# Altium schematic sheet Quadruped.SchDoc
size A; SheetNumber: 1; SheetTotal: 1
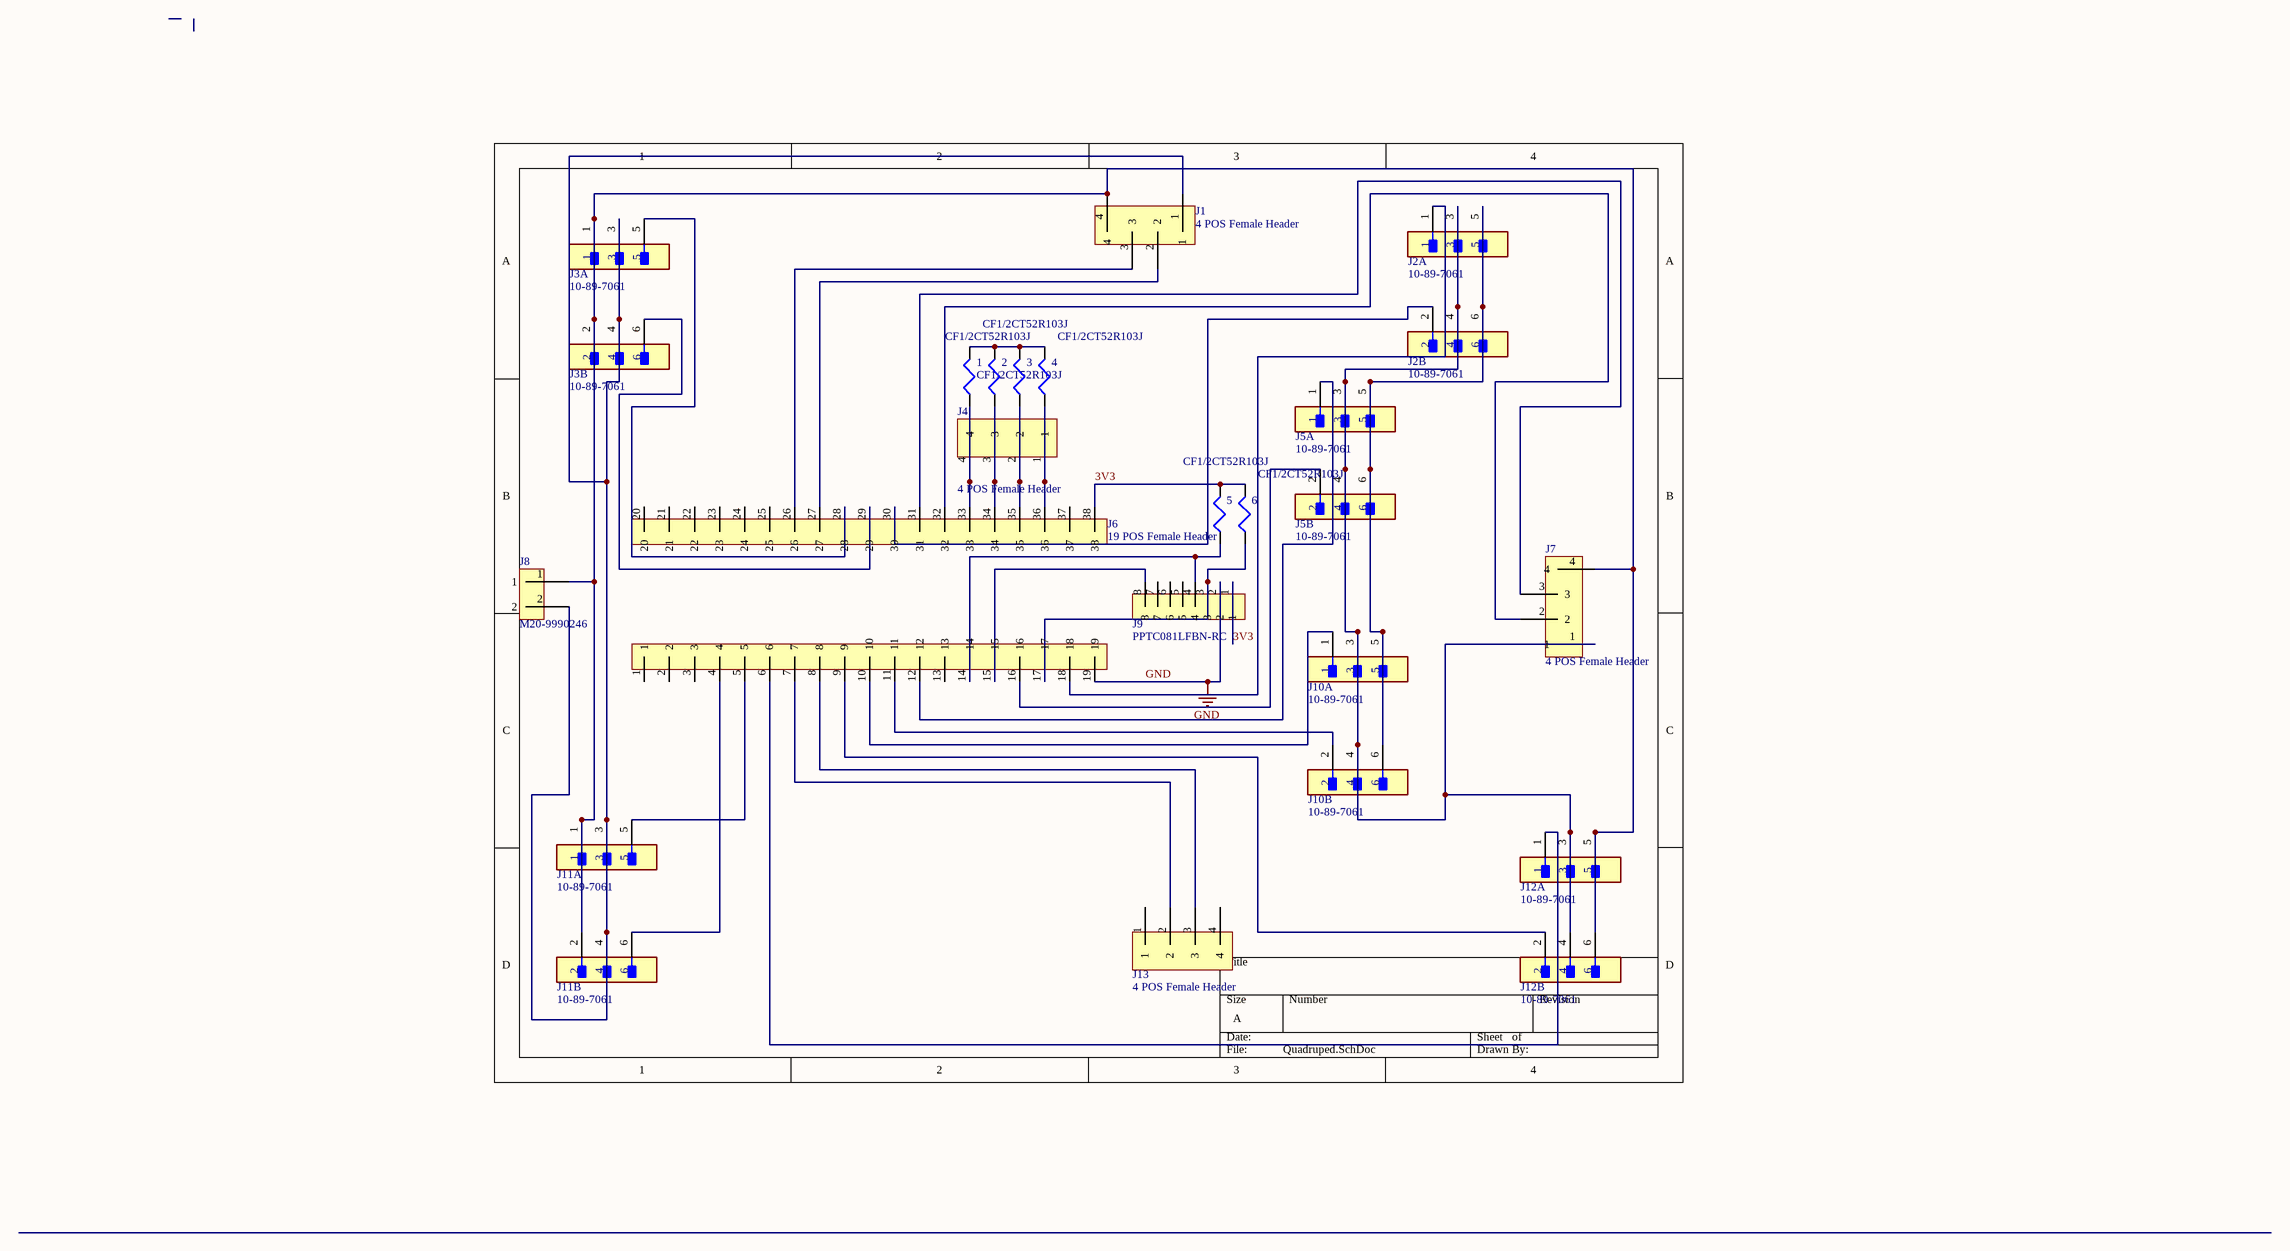
[diagram p0: Quadruped.SchDoc]

## Parts
1  CF1/2CT52R103J  [10K 1/2W]
2  CF1/2CT52R103J  [10K 1/2W]
3  CF1/2CT52R103J  [10K 1/2W]
4  CF1/2CT52R103J  [10K 1/2W]
5  CF1/2CT52R103J  [10K 1/2W]
6  CF1/2CT52R103J  [10K 1/2W]
J1  4 POS Female Header  [SULLINS_PPTC041LFBN-RC]
J2  10-89-7061  [3x2_MALE_HEADER]  (parts A,B of 2)
J3  10-89-7061  [3x2_MALE_HEADER]  (parts A,B of 2)
J4  4 POS Female Header  [SULLINS_PPTC041LFBN-RC]
J5  10-89-7061  [3x2_MALE_HEADER]  (parts A,B of 2)
J6  19 POS Female Header  [ESP_32]
J7  4 POS Female Header  [SULLINS_PPTC041LFBN-RC]
J8  M20-9990246  [2x1_MALE_HEADER]
J9  PPTC081LFBN-RC  [8POS_FEMALE_HEADER]
J10  10-89-7061  [3x2_MALE_HEADER]  (parts A,B of 2)
J11  10-89-7061  [3x2_MALE_HEADER]  (parts A,B of 2)
J12  10-89-7061  [3x2_MALE_HEADER]  (parts A,B of 2)
J13  4 POS Female Header  [SULLINS_PPTC041LFBN-RC]

## Nets
GND: J6.19 J9.2
3V3: 5.2 6.2 J6.38 J9.1
Net1_1: 1.1 J4.4 J6.33
Net1_2: 1.2 2.2 3.2 4.2
Net2_1: 2.1 J4.3 J6.34
Net3_1: 3.1 J4.2 J6.35
Net4_1: 4.1 J4.1 J6.36
Net5_1: 5.1 J6.14 J9.4
Net6_1: 6.1 J6.17 J9.3
NetJ1_1: J1.1 J3.3 J3.4 J8.2 J11.3 J11.4
NetJ1_2: J1.2 J6.27
NetJ1_3: J1.3 J6.26
NetJ1_4: J1.4 J3.1 J3.2 J7.4 J8.1 J11.1 J11.2 J12.5 J12.6
NetJ2_1: J2.1 J6.18
NetJ2_2: J2.2 J6.30
NetJ2_3: J2.3 J2.4 J5.3 J5.4 J7.1 J10.3 J10.4 J12.3 J12.4
NetJ2_5: J2.5 J2.6 J5.5 J5.6 J10.5 J10.6
NetJ3_5: J3.5 J6.28
NetJ3_6: J3.6 J6.29
NetJ5_1: J5.1 J6.12
NetJ5_2: J5.2 J6.16
NetJ6_4: J6.4 J11.6
NetJ6_5: J6.5 J11.5
NetJ6_6: J6.6 J12.1
NetJ6_7: J6.7 J13.2
NetJ6_8: J6.8 J13.3
NetJ6_9: J6.9 J12.2
NetJ6_10: J6.10 J10.1
NetJ6_11: J6.11 J10.2
NetJ6_15: J6.15 J9.8
NetJ6_31: J6.31 J7.3
NetJ6_32: J6.32 J7.2

Not connected (* = marked no-connect by the designer): J6 1 2 3 13 20 21 22 23 24 25 37; J9 5 6 7; J13 1 4

## Library data of the parts
1-6 = CF1/2CT52R103J: Res, 10K, 0.5W, Axial, Carbon Film Rohs Compliant: Yes |Koa CF1/2CT52R103J; Manufacturer: KOA Speer; Value: 10kR; Tolerance: 5%; Power Rating: 500mW; Voltage Rating: 400V; Temperature Coefficient: 350ppm/°C; Supplier: Digi-Key; Supplier Part Number: 2019-CF1/2CT52R103JCT-ND; Manufacturer Part Number: CF1/2CT52R103J; Category: Through-Hole Resistors; Stock: 26977; Pricing: 1=0.12, 10=0.104, 25=0.072, 50=0.0558, 100=0.0399, 250=0.03112, 500=0.02474, 1000=0.01755 (USD); Mounting Technology: Through Hole; Case/Package: Conformal; Min Operating Temperature: -55°C; Max Operating Temperature: 155°C; Packaging: Tape and Reel; Package Quantity: 4000; Termination: Axial; Series: CF; Construction: Cylindrical; Length: 8.5mm; Military Standard: Not; RoHS Compliant: Yes; ComponentLink1URL: https://datasheet.ciiva.com/5478/cf-5478522.pdf?src-supplier=Mouser; ComponentLink1Description: https://datasheet.ciiva.com/5478/cf-5478522.pdf?src-supplier=Mouser; ComponentLink2URL: https://datasheet.octopart.com/CF1-2CT52R103J-KOA-Speer-datasheet-149521760.pdf?src-supplier=Farnell; ComponentLink2Description: https://datasheet.octopart.com/CF1-2CT52R103J-KOA-Speer-datasheet-149521760.pdf?src-supplier=Farnell; ComponentLink3URL: https://datasheet.octopart.com/CF1/2CT52R103J-KOA-Speer-datasheet-160006.pdf?src-supplier=Mouser; ComponentLink3Description: https://datasheet.octopart.com/CF1/2CT52R103J-KOA-Speer-datasheet-160006.pdf?src-supplier=Mouser
J1 J7 = PPPC041LFBN-RC_OPPOSITE: CONN HDR 4POS 0.1 GOLD PCB; Manufacturer: Sullins; Supplier: Digi-Key; Supplier Part Number: S7037-ND; Manufacturer Part Number: PPPC041LFBN-RC; RoHS: Yes; Category: Connectors; Stock: 27520; Pricing: 1=0.47, 10=0.411, 100=0.3391, 500=0.29484, 1000=0.24324, 5000=0.21376, 10000=0.2106 (USD); ComponentLink1URL: https://media.digikey.com/pdf/Data%20Sheets/Sullins%20PDFs/Female_Headers.100_DS.pdf?src-supplier=Digi-Key; ComponentLink1Description: https://media.digikey.com/pdf/Data%20Sheets/Sullins%20PDFs/Female_Headers.100_DS.pdf?src-supplier=Digi-Key; ComponentLink2URL: http://www.sullinscorp.com/catalogs/78_Page80-81_HEADER_.100_2.54mm_FEMALE.pdf?src-supplier=Future+Electronics; ComponentLink2Description: http://www.sullinscorp.com/catalogs/78_Page80-81_HEADER_.100_2.54mm_FEMALE.pdf?src-supplier=Future+Electronics; ComponentLink3URL: https://datasheet.octopart.com/PPPC041LFBN-RC-Sullins-datasheet-41308905.pdf?src-supplier=Future+Electronics; ComponentLink3Description: https://datasheet.octopart.com/PPPC041LFBN-RC-Sullins-datasheet-41308905.pdf?src-supplier=Future+Electronics
J2 J3 J5 J10-J12 = 2654a11fb13586ecb194516b1c997bc: CONN HEADER VERT 6POS 2.54MM; Row Spacing: 0.1inch; Glow Wire Compliant: Non-compliant; Current Rating: 3A; Number of Circuits: 6; Contact Resistance: 15mR; Voltage Rating (DC): 250V; Gender: Male; Connector Type: Male Pin; Lead Free: Lead Free; Radiation Hardening: No; Contact Type: Male Pin; ELV: Compliant; Housing Color: Black; Series: C-Grid® 70280; Number of Rows: 2; Termination: Solder; Housing Material: Thermoplastic; Depth: 5.08mm; RoHS Compliant: Yes; Contact Plating: Tin; Material: Copper Alloy; Contact Material: Brass; Color: Black; Contact Gender: Male; Number of Contacts: 6; Orientation: Straight; Halogen Free: Low Halogen; Mount: Through Hole; Voltage Rating: 250V; Pitch: 2.54mm; Contact Mating Length: 0.24inch; Package Quantity: 1; Packaging: Bulk; Flammability Rating: UL94 V-0; Number of Positions: 6
J4 J13 = PPPC041LFBN-RC: CONN HDR 4POS 0.1 GOLD PCB; Manufacturer: Sullins; Supplier: Digi-Key; Supplier Part Number: S7037-ND; Manufacturer Part Number: PPPC041LFBN-RC; RoHS: Yes; Category: Connectors; Stock: 27520; Pricing: 1=0.47, 10=0.411, 100=0.3391, 500=0.29484, 1000=0.24324, 5000=0.21376, 10000=0.2106 (USD); ComponentLink1URL: https://media.digikey.com/pdf/Data%20Sheets/Sullins%20PDFs/Female_Headers.100_DS.pdf?src-supplier=Digi-Key; ComponentLink1Description: https://media.digikey.com/pdf/Data%20Sheets/Sullins%20PDFs/Female_Headers.100_DS.pdf?src-supplier=Digi-Key; ComponentLink2URL: http://www.sullinscorp.com/catalogs/78_Page80-81_HEADER_.100_2.54mm_FEMALE.pdf?src-supplier=Future+Electronics; ComponentLink2Description: http://www.sullinscorp.com/catalogs/78_Page80-81_HEADER_.100_2.54mm_FEMALE.pdf?src-supplier=Future+Electronics; ComponentLink3URL: https://datasheet.octopart.com/PPPC041LFBN-RC-Sullins-datasheet-41308905.pdf?src-supplier=Future+Electronics; ComponentLink3Description: https://datasheet.octopart.com/PPPC041LFBN-RC-Sullins-datasheet-41308905.pdf?src-supplier=Future+Electronics
J6 = PPTC191LFBN-RC: CONN HDR 19POS 0.1 TIN PCB; Manufacturer: Sullins; Number of Positions: 19; Voltage Rating: 250V; Supplier: Digi-Key; Supplier Part Number: S7017-ND; Manufacturer Part Number: PPTC191LFBN-RC; RoHS: Yes; Category: Connectors; Stock: 11638; Pricing: 1=1.18, 10=0.997, 80=0.89488, 440=0.73218, 1000=0.65083, 5000=0.5811 (USD); Mounting Technology: Through Hole; Contact Material: Bronze; Housing Material: Plastic; Contact Finish - Mating: TIN; Insulation Color: Black; Insulation Material: Polyester; Contact Shape: Square; Min Operating Temperature: -40°C; Max Operating Temperature: 105°C; Number of Rows: 1; Packaging: Tray; Termination: Solder; Contact Type: Female Socket; Series: -; Fastening Type: Pull; Connector Type: Header; Length: 48.8mm; Width: 2.5mm; Height: 8.5mm; Lead Free: Lead Free; RoHS Compliant: Yes; Flammability Rating: UL94 V-0; ComponentLink1URL: https://s3.amazonaws.com/catalogspreads-pdf/PAGE114-115%20.100%20FEMALE%20HDR.pdf?src-supplier=Digi-Key; ComponentLink1Description: https://s3.amazonaws.com/catalogspreads-pdf/PAGE114-115%20.100%20FEMALE%20HDR.pdf?src-supplier=Digi-Key
J8 = M20-9990246: 2.54mm (0.1") Pitch SIL Vertical PC Tail Pin Header, 6.1mm mating pin height, tin, 2 contacts; Manufacturer: Harwin; Supplier: Rs; Supplier Part Number: 7457065; Manufacturer Part Number: M20-9990246; RoHS: Yes; Category: Headers and Wire Housings; Stock: 4090; ComponentLink1URL: https://datasheet.ciiva.com/8046/315376-8046930.pdf?src-supplier=Element14; ComponentLink1Description: https://datasheet.ciiva.com/8046/315376-8046930.pdf?src-supplier=Element14; ComponentLink2URL: https://datasheet.ciiva.com/11745/0900766b81034e61-11745755.pdf?src-supplier=Rs; ComponentLink2Description: https://datasheet.ciiva.com/11745/0900766b81034e61-11745755.pdf?src-supplier=Rs; ComponentLink3URL: https://datasheet.ciiva.com/22660/1830818-22660571.pdf?src-supplier=Element14; ComponentLink3Description: https://datasheet.ciiva.com/22660/1830818-22660571.pdf?src-supplier=Element14; ComponentLink4URL: https://datasheet.ciiva.com/6833/m20-999-6833368.pdf?src-supplier=Digi-Key; ComponentLink4Description: https://datasheet.ciiva.com/6833/m20-999-6833368.pdf?src-supplier=Digi-Key; ComponentLink5URL: https://datasheet.ciiva.com/26852/getdatasheetpartid-384170-26852203.pdf?src-supplier=Verical; ComponentLink5Description: https://datasheet.ciiva.com/26852/getdatasheetpartid-384170-26852203.pdf?src-supplier=Verical
J9 = PPTC081LFBN-RC: Female, 8C, Straight, .100"CC; 3.20mm Tail, No Mt. 100u" Tin; PBT, Phos Bronze, 105 C; Manufacturer: Sullins; Supplier: Digi-Key; Supplier Part Number: S7006-ND; Manufacturer Part Number: PPTC081LFBN-RC; RoHS: Yes; Category: Connectors; Stock: 25448; Pricing: 1=0.65, 10=0.565, 400=0.42525, 800=0.3645, 1200=0.33413, 5200=0.29363, 10000=0.2925 (USD); ComponentLink1URL: https://media.digikey.com/pdf/Data%20Sheets/Sullins%20PDFs/Female_Headers.100_DS.pdf?src-supplier=Digi-Key; ComponentLink1Description: https://media.digikey.com/pdf/Data%20Sheets/Sullins%20PDFs/Female_Headers.100_DS.pdf?src-supplier=Digi-Key; ComponentLink2URL: https://datasheet.octopart.com/PPTC081LFBN-RC-Sullins-datasheet-41308905.pdf?src-supplier=Future+Electronics; ComponentLink2Description: https://datasheet.octopart.com/PPTC081LFBN-RC-Sullins-datasheet-41308905.pdf?src-supplier=Future+Electronics; ComponentLink3URL: http://www.sullinscorp.com/catalogs/78_Page80-81_HEADER_.100_2.54mm_FEMALE.pdf?src-supplier=Future+Electronics; ComponentLink3Description: http://www.sullinscorp.com/catalogs/78_Page80-81_HEADER_.100_2.54mm_FEMALE.pdf?src-supplier=Future+Electronics